# EAGLE design Adafruit MPL115A2 Breakout (EAGLE 6.2)
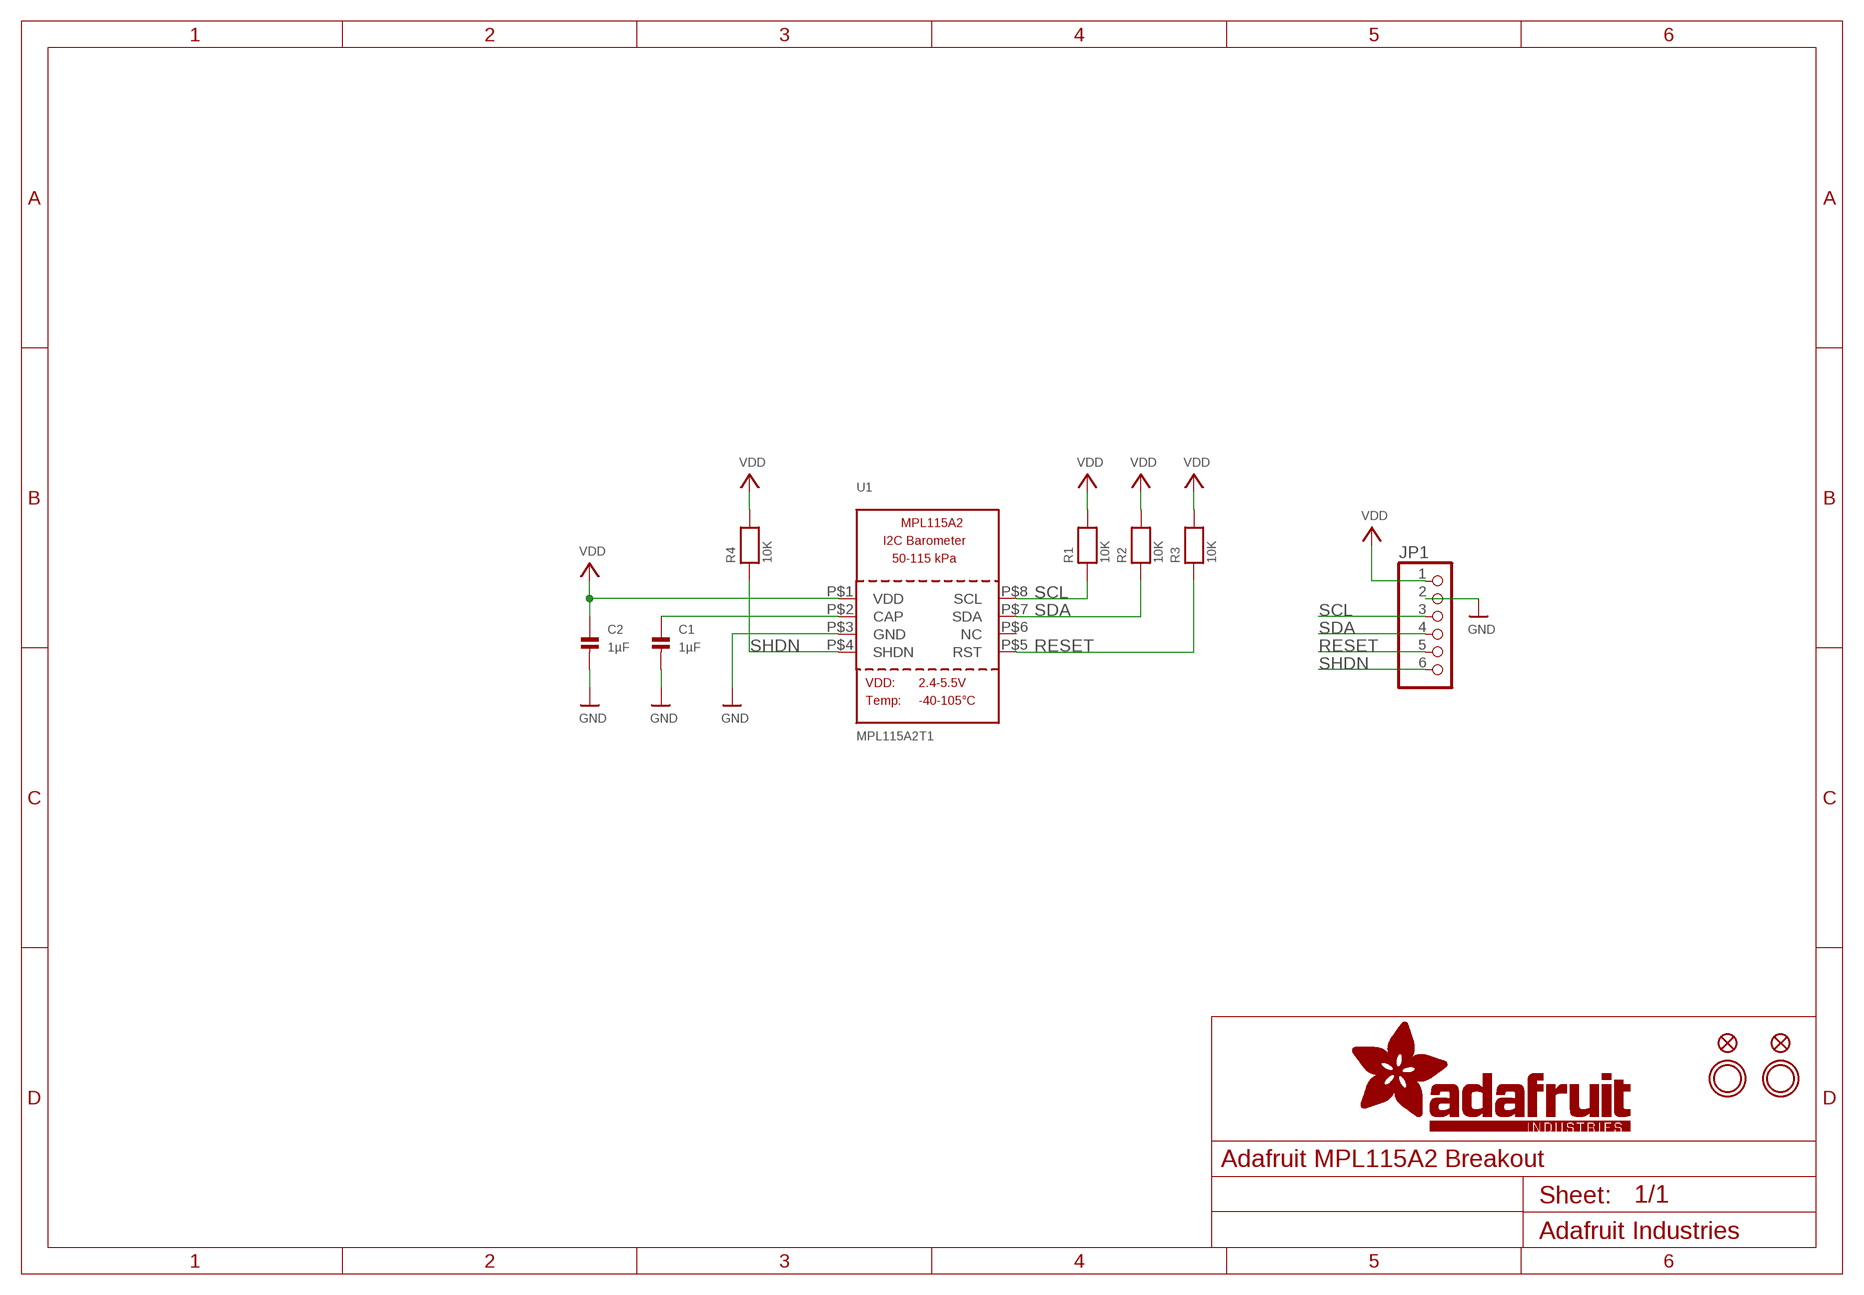
[diagram p0: schematic, sheet 1]

## Parts
C1  1µF  CAP_CERAMIC0805  [0805]
C2  1µF  CAP_CERAMIC0805  [0805]
FID1  FIDUCIAL""  [FIDUCIAL_1MM]
FID2  FIDUCIAL""  [FIDUCIAL_1MM]
JP1  HEADER-1X670MIL  [1X06_ROUND_70]
R1  10K  RESISTOR0805  [0805]
R2  10K  RESISTOR0805  [0805]
R3  10K  RESISTOR0805  [0805]
R4  10K  RESISTOR0805  [0805]
U1  MPL115A2T1  MPL115A2  [LGA8]
U$8  MOUNTINGHOLE2.5  [MOUNTINGHOLE_2.5_PLATED]
U$9  MOUNTINGHOLE2.5  [MOUNTINGHOLE_2.5_PLATED]

## Nets
GND: C1.2 C2.2 JP1.2 U1.P$3(GND)
N$1: C1.1 U1.P$2(CAP)
RESET: JP1.5 R3.1 U1.P$5(RST)
SCL: JP1.3 R1.1 U1.P$8(SCL)
SDA: JP1.4 R2.1 U1.P$7(SDA)
SHDN: JP1.6 R4.1 U1.P$4(SHDN)
VDD: C2.1 JP1.1 R1.2 R2.2 R3.2 R4.2 U1.P$1(VDD)
Unconnected: U1.P$6(NC)

## Library data of the parts
C1 C2 = microbuilder:CAP_CERAMIC: Ceramic Capacitors 0402 - 0402 Surface Mount Capacitors 16pF 50V 5% [Digikey: 445-4899-2-ND] 18pF 50V 5% [Digikey: 490-1281-2-ND] 22pF 50V 5% [Digikey: 490-1283-2-ND] 68pF 50V 5% [Digikey: 490-1289-2-ND] 0.1uF 10V 10% [Digikey: 490-1318-2-ND] 1.0uF 6.3V 10% [Digikey: 490-1320-2-ND] 0603 - 0603 Surface Mount Capacitors 16 pF 50V 5% [Digikey: 445-5051-2-ND] 22 pF 50V [Digikey: PCC220ACVTR-ND] 33 pF 50V 5% [Digikey: 490-1415-1-ND] 56pF 50V 5% [Digikey: 490-1421-1-ND] 220pF 50V 5% [Digikey: 445-1285-1-ND] 680 pF 50V 2200 pF 50V 5% C0G [Digikey: 445-1297-1-ND] 5600 pF 100V 5% X7R [Digikey: 478-3711-1-ND] 0.1 µF 25V 10% [Digikey: PCC2277TR-ND] 0.22 µF 16V 10% X7R [Digikey: 445-1318-1-ND] 1.0 µF 25V 10% [Digikey: 445-5146-2-ND] 0603 - RF Specific 3pF 250V +/-0.1pF RF [Digikey: 712-1347-1-ND] 18 pF 250V 5% [Digikey: 478-3505-1-ND or 712-1322-1-ND] 56 pF 250V 5% C0G RF [Digikey: 490-4867-1-ND] 68 pF 250V RF [Digikey: 490-4868-1-ND] 0805 - 0805 Surface Mount Capacitors 220 pF 250V 2% RF Ceramic Capacitor [Digikey: 712-1398-1-ND] 1000 pF 50V 2% NP0 Ceramic Capacitor [Digikey: 478-3760-1-ND] 0.1 µF 25V 10% Ceramic Capacitor [Digikey: PCC1828TR-ND] 1.0 µF 16V 10% Ceramic Capacitor[Digikey: 490-1691-2-ND] 10.0 µF 10V 10% Ceramic Capacitor[Digikey: 709-1228-1-ND] 10.0 uF 16V 10% Ceramic Capacitor [Digikey: 478-5165-2-ND] 47 uF 6.3V 20% Ceramic Capacitor [Digikey: 587-1779-1-ND or 399-5506-1-ND] 1206 - 1206 Surface Mount Capacitors 47uF 10V 20% Ceramic Capacitor [Digikey: 490-5528-1-ND or 399-5508-1-ND or 445-6010-1-ND] 100uF 6.3V -20%, +80% Y5V Ceramic Capacitor (Digikey: 490-4512-1-ND, Mouser: 81-GRM31CF50J107ZE1L)
FID1 FID2 = microbuilder:FIDUCIAL: Fiducial Alignment Points Various fiducial points for machine vision alignment.
JP1 = microbuilder:HEADER-1X6: PIN HEADER
R1-R4 = microbuilder:RESISTOR: Resistors 0402 - 0402 Surface Mount Package 22 Ohm 1% 1/16W [Digikey: 311-22.0LRTR-ND] 33 Ohm 5% 1/16W 1.0K 5% 1/16W 1.5K 5% 1/16W 2.0K 1% 1/16W 10.0K 1% 1/16W [Digikey: 311-10.0KLRTR-ND] 10.0K 5% 1/16W [Digikey: RMCF0402JT10K0TR-ND] 12.1K 1% 1/16W [Digikey: 311-22.0LRTR-ND] 100.0K 5% 1/16W 0603 - 0603 Surface Mount Package 0 Ohm 1/10 Watt 1% Resistor 15 Ohm 1/10 Watt 1% Resistor 33 Ohm 1/10 Watt 1% Resistor 49.9 Ohm 1/10 Watt 1% Resistor 100 Ohm 1/10 Watt 1% Resistor 150 Ohm 1/10 Watt 1% Resistor 240 Ohm 1/10 Watt 1% Resistor 390 Ohm 1/10 Watt 1% Resistor 560 Ohm 1/10 Watt 1% Resistor 680 Ohm 1/10 Watt 1% Resistor 750 Ohm 1/10 Watt 1% Resistor 1.0K Ohm 1/10 Watt 1% Resistor 1.5K Ohm 1/10 Watt 1% Resistor 2.0K Ohm 1/10 Watt 1% Resistor 2.2K Ohm 1/10 Watt 1% Resistor 3.3K Ohm 1/10 Watt 1% Resistor 4.7K Ohm 1/10 Watt 1% Resistor 10.0K Ohm 1/10 Watt 1% Resistor 12.0K Ohm 1/10 Watt 1% Resistor 12.1K Ohm 1/10 Watt 1% Resistor 20.0K Ohm 1/10 Watt 1% Resistor 33.0K Ohm 1/10 Watt 1% Resistor 100.0K Ohm 1/10 Watt 1% Resistor 0805 - 0805 Surface Mount Package 0 Ohm 1/8 Watt 1% Resistor 33 Ohm 1/8 Watt 1% Resistor 100 Ohm 1/8 Watt 1% Resistor 150 Ohm 1/8 Watt 1% Resistor 200 Ohm 1/8 Watt 1% Resistor 240 Ohm 1/8 Watt 1% Resistor 330 Ohm 1/8 Watt 1% Resistor 390 Ohm 1/8 Watt 1% Resistor 470 Ohm 1/8 Watt 1% Resistor 1.0K Ohm 1/8 Watt 1% Resistor 1.5K Ohm 1/8 Watt 1% Resistor 2.0K Ohm 1/8 Watt 1% Resistor 4.7K Ohm 1/8 Watt 1% Resistor 5.1K Ohm 1/8 Watt 1% Resistor 5.6K Ohm 1/8 Watt 1% Resistor 10.0K Ohm 1/8 Watt 1% Resistor 22.0K Ohm 1/8 Watt 1% Resistor 33.0K Ohm 1/8 Watt 1% Resistor 100K Ohm 1/8 Watt 1% Resistor 1206 - 1206 Surface Mount Package 2012 - 2010 Surface Mount Package 0.11 Ohm 1/2 Watt 1% Resistor - Digikey: RHM.11UCT-ND
U1 = microbuilder:MPL115A2: MPL115A2 I2C Barometric Pressure Sensor (50-115 kPa/7.25-16.68 PSI) - LGA8 Package Digikey: MPL115A2T1CT-ND
U$8 U$9 = microbuilder:MOUNTINGHOLE: Mounting Hole For #2 screws (0.086"/2.18mm width, 0.094"/2.4mm hole) use 2.5mm

## Board
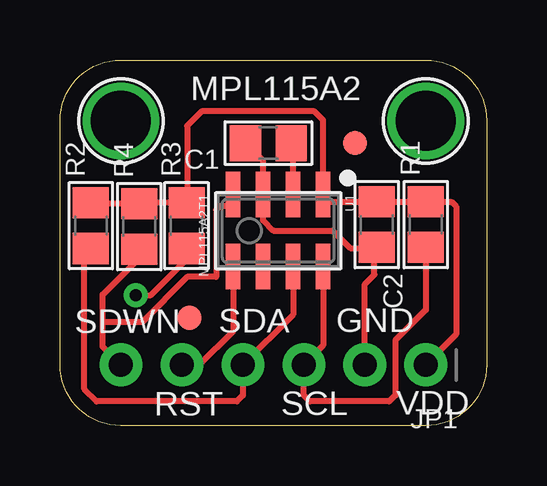
[diagram p1: board, top side]
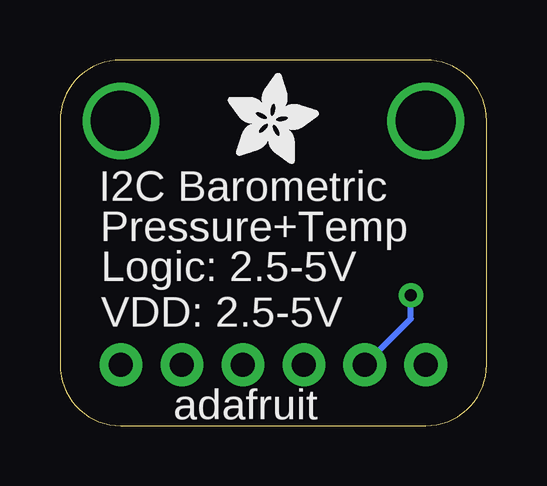
[diagram p2: board, bottom side, seen from below]

Size 17.78 x 15.24 mm. Coordinates in mm from the lower left corner, seen from the top.
Outline: 0,2.54 0,12.7 arc-90 2.54,15.24 15.24,15.24 arc-90 17.78,12.7 17.78,2.54 arc-90 15.24,0 2.54,0 arc-90 0,2.54
Copper layers (1*16): Top 0.035mm / dielectric 1.5mm / Bottom 0.035mm
Design rules "default": minimum track width 8mil, minimum drill 0.4mm, track to track 8mil, track to pad 8mil, pad to pad 8mil, via to via 8mil, smd to smd 8mil, copper to edge 20mil, drill to drill 8mil, minimum pad ring 8mil, minimum via ring 10mil, stop-mask expansion 3mil, vias tented up to drill 20mil, thermal gap 8mil

### Footprints (pad centres in the part's own frame; a part is rotated, then mirrored left to right if it is on the bottom)
0805 = smd 1.3 x 1.5: 1 -0.95,0; 2 0.95,0
FIDUCIAL_1MM = smd 1 x 1: 1 0,0
1X06_ROUND_70 = drill 1 pad 1.778: 1 -6.35,0; 2 -3.81,0; 3 -1.27,0; 4 1.27,0; 5 3.81,0; 6 6.35,0
LGA8 = smd 1.9 x 0.6: P$1 -1.5,1.875; P$2 -1.5,0.625; P$3 -1.5,-0.625; P$4 -1.5,-1.875; P$5 1.5,-1.875; P$6 1.5,-0.625; P$7 1.5,0.625; P$8 1.5,1.875
MOUNTINGHOLE_2.5_PLATED = drill 2.5 pad 3.2: P$1 0,0

### Placement (x,y rotation side)
C1  8.68,11.78 180 top
C2  13.2,8.38 270 top
FID1  5.4,4.5 0 top
FID2  12.29,11.78 0 top
JP1  8.89,2.54 180 top
R1  15.24,8.38 90 top
R2  1.29,8.34 90 top
R3  5.27,8.34 90 top
R4  3.3,8.3 90 top
U1  9.09,8.13 270 top
U$8  2.54,12.7 0 top
U$9  15.24,12.7 0 top
U$14  [ADAFRUIT_3.5MM]  10.8,10.9 0 bottom

### Tracks (layer width: path | path; a pad name or v marks a point on that pad's centre or on a via)
GND
  Top 0.254: JP1.2 12.7,5.9 13.1,6.3 13.1,7.33 C2.2 13.17,7.4 12.1,7.4 11.37,8.13 8.89,8.13 8.46,8.55 U1.P$3 8.46,11.04 C1.2
N$1
  Top 0.254: U1.P$2 9.71,11.69 C1.1
RESET  (via drill 0.5)
  Top 0.254: U1.P$5 7.21,3.94 5.81,2.54 JP1.5 | v3.16,5.44 3.79,5.44 5.21,6.86 5.21,7.32 R3.1
  Bottom 0.254: JP1.5 3.16,4.46 v3.16,5.44
SCL
  Top 0.254: R1.1 15.24,4.83 13.97,3.56 13.97,1.27 13.72,1.02 10.41,1.02 10.16,1.27 JP1.3 10.77,3.15 10.96,3.35 U1.P$8
SDA
  Top 0.254: U1.P$7 9.71,4.63 JP1.4 7.62,1.27 7.37,1.02 1.52,1.02 1.02,1.52 1.02,7.12 1.29,7.12 R2.1 1.27,7.39 1.27,7.37
  Top 0.406: 1.02,7.42 1.27,7.42 1.27,7.37
SHDN
  Top 0.254: 3.3,7.2 R4.1 3.3,6.98 1.78,5.46 1.78,4.32 | U1.P$4 7.21,9.36 7,9.14 6.64,9.14 6.5,9 6.5,6.2 5.3,6.2 3.42,4.32 1.78,4.32 | JP1.6 1.78,3.3 1.78,4.32
VDD
  Top 0.254: JP1.1 16.51,3.81 16.51,9.14 16.32,9.33 R1.2 C2.1 11.26,9.33 U1.P$1 10.96,12.73 10.6,13.1 5.9,13.1 5.3,12.5 5.3,9.61 5.27,9.59 R3.2 3.34,9.29 R4.2 1.32,9.25 R2.2

### Text on the board
tPlace: MPL115A2 | SDWN | SDA | GND | RST | SCL | VDD
bPlace: I2C Barometric | Pressure+Temp | Logic: 2.5-5V | VDD: 2.5-5V | adafruit